# EAGLE design SPI Memory (EAGLE 6.3)
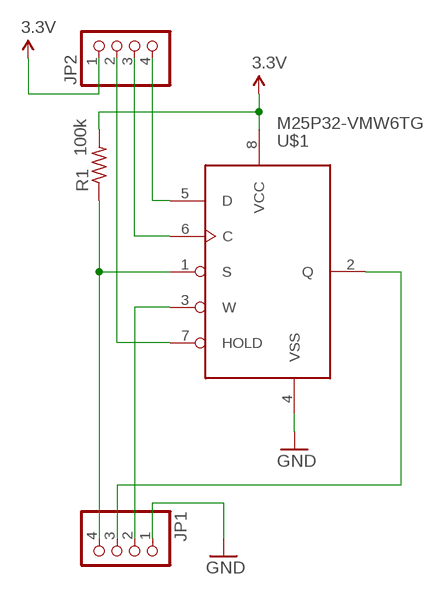
[diagram p0: schematic, sheet 1]

## Parts
JP1  PINHD-1X4  [1X04]
JP2  PINHD-1X4  [1X04]
R1  100k  0603_RESISTOR  [0603_RESISTOR]
U$1  M25P32-VMW6TG  SOIC8-W_MEMORY  [SOIC8_W]

## Nets
3.3V: JP2.1 R1.2 U$1.8(VCC)
GND: JP1.1 U$1.4(VSS)
N$1: JP1.3 U$1.2(Q)
N$2: JP1.4 R1.1 U$1.1(S)
N$3: JP1.2 U$1.3(W)
N$4: JP2.2 U$1.7(HOLD)
N$5: JP2.3 U$1.6(C)
N$6: JP2.4 U$1.5(D)

## Library data of the parts
JP1 JP2 = pinhead:PINHD-1X4: PIN HEADER
R1 = jkf-parts:0603_RESISTOR
U$1 = jkf-parts:SOIC8-W_MEMORY: SOIC8-W Memory 4M x 8 - M25P32-VMW6TG

## Net classes
0 default: clearance 0.254 mm

## Board
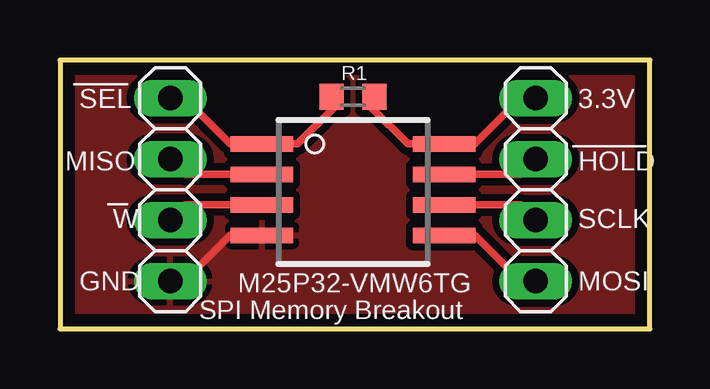
[diagram p1: board, top side]
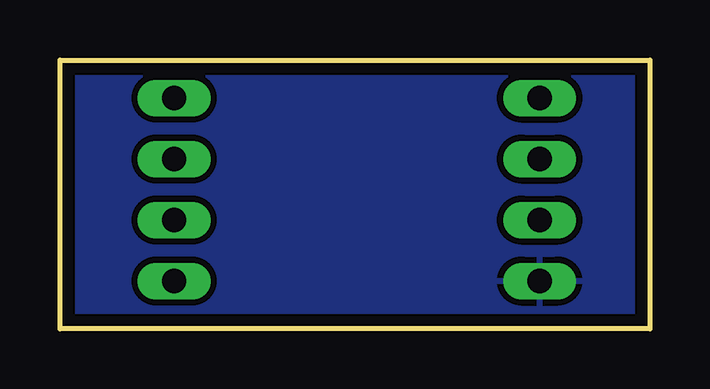
[diagram p2: board, bottom side, seen from below]

Size 24.6 x 11.2 mm. Coordinates in mm from the lower left corner, seen from the top.
Outline: 0,0 24.6,0 24.6,11.2 0,11.2 0,0
Copper layers (1*16): Top 0.0178mm / dielectric 59mil / Bottom 0.0178mm
Design rules "SSC-EAGLE-2Lyr_v1.0.0.3": minimum track width 6mil, minimum drill 14mil, track to track 6mil, track to pad 6mil, pad to pad 6mil, via to via 6mil, smd to smd 6mil, copper to edge 20mil, drill to drill 16mil, minimum pad ring 8mil, minimum via ring 8mil, stop-mask expansion 3mil, vias tented up to drill 0mil, thermal gap 10mil

### Footprints (pad centres in the part's own frame; a part is rotated, then mirrored left to right if it is on the bottom)
1X04 = drill 1.016 long: 1 -3.81,0; 2 -1.27,0; 3 1.27,0; 4 3.81,0
0603_RESISTOR = smd 1 x 1.1: 1 -0.9,0; 2 0.9,0
SOIC8_W = smd 0.65 x 2.6: 1 -1.9,-3.8; 2 -0.63,-3.8; 3 0.64,-3.8; 4 1.91,-3.8; 5 1.91,3.8; 6 0.64,3.8; 7 -0.63,3.8; 8 -1.9,3.8

### Placement (x,y rotation side)
JP1  4.6,5.8 90 top
JP2  19.84,5.8 270 top
R1  12.22,9.67 0 top
U$1  12.22,5.8 270 top

### Tracks (layer width: path | path; a pad name or v marks a point on that pad's centre or on a via)
3.3V
  Top 0.305: JP2.1 19.2,9.6 17.3,7.7 U$1.8 14.5,7.7 13,9.2 13,9.55 R1.2
GND
  Top 0.305: U$1.4 7.09,3.89 5.2,2 JP1.1
  pour Bottom: 0,11.2 24.6,11.2 24.6,0 0,0
  pour Top (isolate 0.305): 0,11.2 24.6,11.2 24.6,0 0,0
N$1
  Top 0.305: U$1.2 5.24,6.43 JP1.3
N$2
  Top 0.305: JP1.4 5.2,9.6 7.1,7.7 U$1.1 9.9,7.7 11.4,9.2 11.4,9.59 R1.1
N$3
  Top 0.305: U$1.3 5.23,5.16 JP1.2
N$4
  Top 0.305: U$1.7 19.2,6.43 JP2.2
N$5
  Top 0.305: U$1.6 19.21,5.16 JP2.3
N$6
  Top 0.305: U$1.5 17.31,3.89 19.2,2 JP2.4

### Text on the board
tSilk: SEL | 3.3V | MISO | HOLD | W | SCLK | GND | MOSI | SPI Memory Breakout